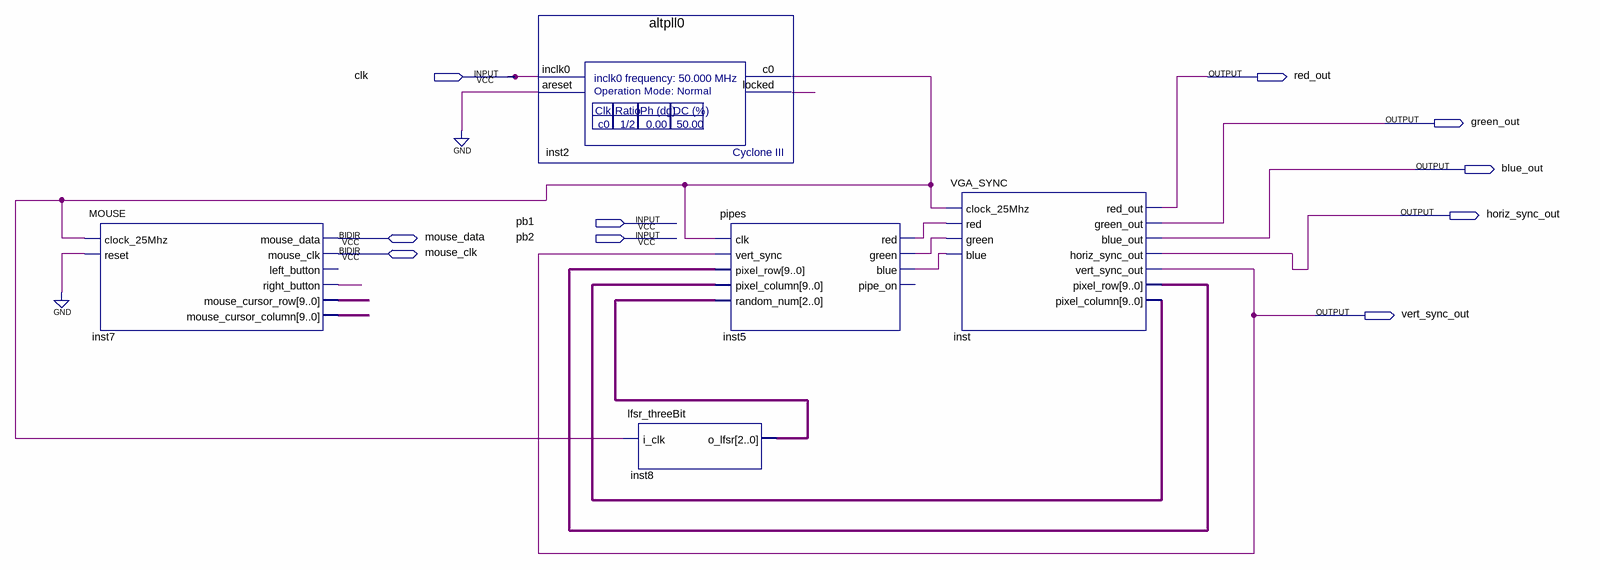
[diagram p0: schematic sheet]
// Quartus schematic FlipFlopBird.bdf as structural Verilog: 5 symbols, 10 pins
module FlipFlopBird (
  input  clk,
  input  pb1,
  input  pb2,
  inout  mouse_data,
  inout  mouse_clk,
  output red_out,
  output green_out,
  output blue_out,
  output horiz_sync_out,
  output vert_sync_out
);

  wire inst2_c0, inst2_locked, inst5_blue, inst5_green, inst5_red, inst7_right_button;
  wire [2:0] inst8_o_lfsr;
  wire [9:0] inst7_mouse_cursor_column, inst7_mouse_cursor_row, inst_pixel_column, inst_pixel_row;

  MOUSE inst7 (
    .clock_25Mhz(inst2_c0), .reset(1'b0), .right_button(inst7_right_button),
    .mouse_cursor_row(inst7_mouse_cursor_row), .mouse_cursor_column(inst7_mouse_cursor_column),
    .mouse_data(mouse_data), .mouse_clk(mouse_clk));  // open: left_button
  altpll0 inst2 (.inclk0(clk), .areset(1'b0), .c0(inst2_c0), .locked(inst2_locked));
  lfsr_threeBit inst8 (.i_clk(inst2_c0), .o_lfsr(inst8_o_lfsr));
  pipes inst5 (
    .clk(inst2_c0), .vert_sync(vert_sync_out), .pixel_row(inst_pixel_row), .pixel_column(inst_pixel_column),
    .random_num(inst8_o_lfsr), .red(inst5_red), .green(inst5_green), .blue(inst5_blue));  // open: pipe_on
  VGA_SYNC inst (
    .clock_25Mhz(inst2_c0), .red(inst5_red), .green(inst5_green), .blue(inst5_blue), .red_out(red_out),
    .green_out(green_out), .blue_out(blue_out), .horiz_sync_out(horiz_sync_out),
    .vert_sync_out(vert_sync_out), .pixel_row(inst_pixel_row), .pixel_column(inst_pixel_column));
endmodule
